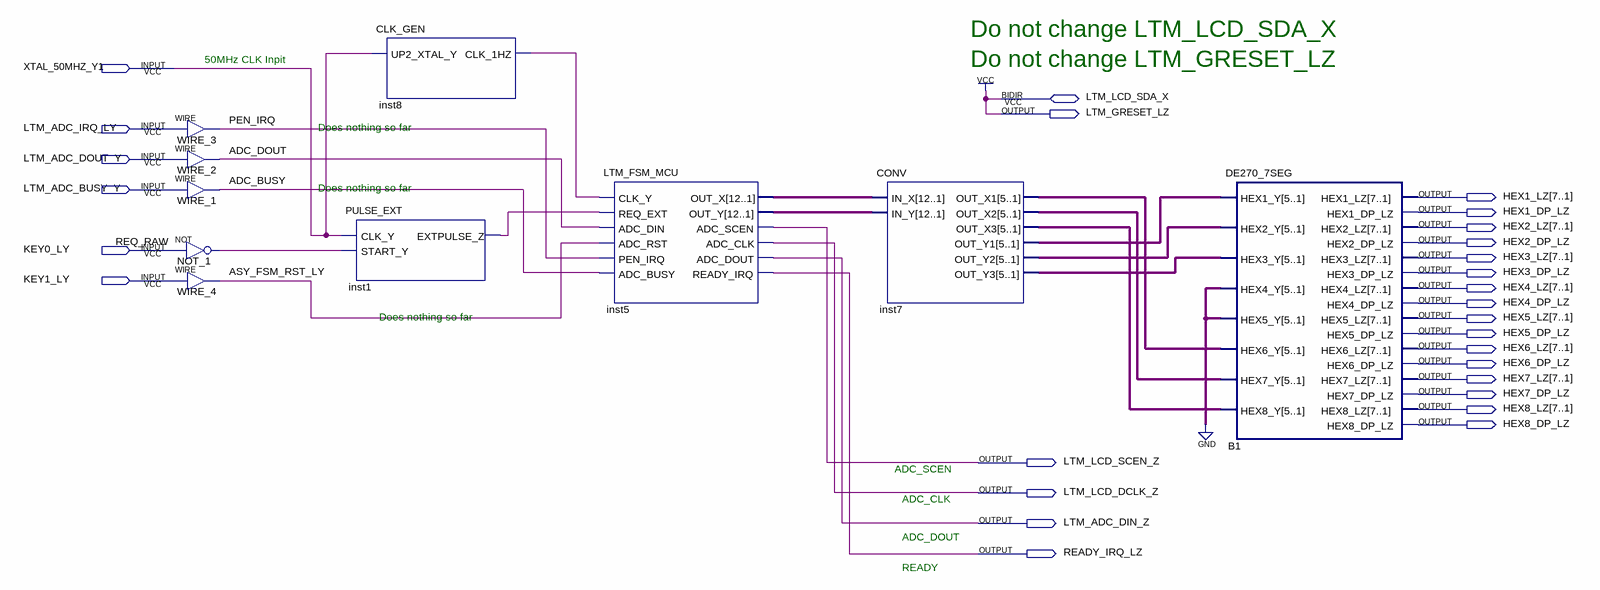
[diagram p0: schematic sheet]
// Quartus schematic LTM_DE270.bdf as structural Verilog: 10 symbols, 28 pins
module LTM_DE270 (
  input  XTAL_50MHZ_Y1,
  input  LTM_ADC_IRQ_LY,
  input  LTM_ADC_DOUT_Y,
  input  LTM_ADC_BUSY_Y,
  input  KEY0_LY,
  input  KEY1_LY,
  inout  LTM_LCD_SDA_X,
  output LTM_GRESET_LZ,
  output [7:1] HEX1_LZ,
  output HEX1_DP_LZ,
  output [7:1] HEX2_LZ,
  output HEX2_DP_LZ,
  output [7:1] HEX3_LZ,
  output HEX3_DP_LZ,
  output [7:1] HEX4_LZ,
  output HEX4_DP_LZ,
  output [7:1] HEX5_LZ,
  output HEX5_DP_LZ,
  output [7:1] HEX6_LZ,
  output HEX6_DP_LZ,
  output [7:1] HEX7_LZ,
  output HEX7_DP_LZ,
  output [7:1] HEX8_LZ,
  output HEX8_DP_LZ,
  output LTM_LCD_SCEN_Z,
  output LTM_LCD_DCLK_Z,
  output LTM_ADC_DIN_Z,
  output READY_IRQ_LZ
);

  wire ADC_BUSY, ADC_DOUT, ASY_FSM_RST_LY, inst1_extpulse_z, inst8_clk_1hz, PEN_IRQ, REQ_RAW;
  wire [4:0] inst7_out_x1, inst7_out_x2, inst7_out_x3, inst7_out_y1, inst7_out_y2, inst7_out_y3;
  wire [11:0] inst5_out_x, inst5_out_y;

  assign PEN_IRQ = LTM_ADC_IRQ_LY;  // WIRE WIRE_3
  assign ADC_DOUT = LTM_ADC_DOUT_Y;  // WIRE WIRE_2
  assign ADC_BUSY = LTM_ADC_BUSY_Y;  // WIRE WIRE_1
  not NOT_1 (REQ_RAW, KEY0_LY);
  assign ASY_FSM_RST_LY = KEY1_LY;  // WIRE WIRE_4
  CLK_GEN inst8 (.UP2_XTAL_Y(XTAL_50MHZ_Y1), .CLK_1HZ(inst8_clk_1hz));
  PULSE_EXT inst1 (.CLK_Y(XTAL_50MHZ_Y1), .START_Y(REQ_RAW), .EXTPULSE_Z(inst1_extpulse_z));
  LTM_FSM_MCU inst5 (
    .CLK_Y(inst8_clk_1hz), .REQ_EXT(inst1_extpulse_z), .ADC_DIN(ADC_DOUT), .ADC_RST(ASY_FSM_RST_LY),
    .PEN_IRQ(PEN_IRQ), .ADC_BUSY(ADC_BUSY), .OUT_X(inst5_out_x), .OUT_Y(inst5_out_y),
    .ADC_SCEN(LTM_LCD_SCEN_Z), .ADC_CLK(LTM_LCD_DCLK_Z), .ADC_DOUT(LTM_ADC_DIN_Z), .READY_IRQ(READY_IRQ_LZ));
  CONV inst7 (
    .IN_X(inst5_out_x), .IN_Y(inst5_out_y), .OUT_X1(inst7_out_x1), .OUT_X2(inst7_out_x2),
    .OUT_X3(inst7_out_x3), .OUT_Y1(inst7_out_y1), .OUT_Y2(inst7_out_y2), .OUT_Y3(inst7_out_y3));
  DE270_7SEG B1 (
    .HEX1_Y(inst7_out_y1), .HEX2_Y(inst7_out_y2), .HEX3_Y(inst7_out_y3), .HEX4_Y({5{1'b0}}),
    .HEX5_Y({5{1'b0}}), .HEX6_Y(inst7_out_x1), .HEX7_Y(inst7_out_x2), .HEX8_Y(inst7_out_x3),
    .HEX1_LZ(HEX1_LZ), .HEX1_DP_LZ(HEX1_DP_LZ), .HEX2_LZ(HEX2_LZ), .HEX2_DP_LZ(HEX2_DP_LZ),
    .HEX3_LZ(HEX3_LZ), .HEX3_DP_LZ(HEX3_DP_LZ), .HEX4_LZ(HEX4_LZ), .HEX4_DP_LZ(HEX4_DP_LZ),
    .HEX5_LZ(HEX5_LZ), .HEX5_DP_LZ(HEX5_DP_LZ), .HEX6_LZ(HEX6_LZ), .HEX6_DP_LZ(HEX6_DP_LZ),
    .HEX7_LZ(HEX7_LZ), .HEX7_DP_LZ(HEX7_DP_LZ), .HEX8_LZ(HEX8_LZ), .HEX8_DP_LZ(HEX8_DP_LZ));

  assign LTM_GRESET_LZ = LTM_LCD_SDA_X;
  // also tied to VCC on the sheet: LTM_LCD_SDA_X

  // Notes on the sheet:
  //   Do not change LTM_LCD_SDA_X
  //   Do not change LTM_GRESET_LZ
  //   50MHz CLK Inpit
  //   Does nothing so far
  //   Does nothing so far
  //   Does nothing so far
  //   ADC_SCEN
  //   ADC_CLK
  //   ADC_DOUT
  //   READY
endmodule
